# Altium project TRACKBAT.PRJPCB
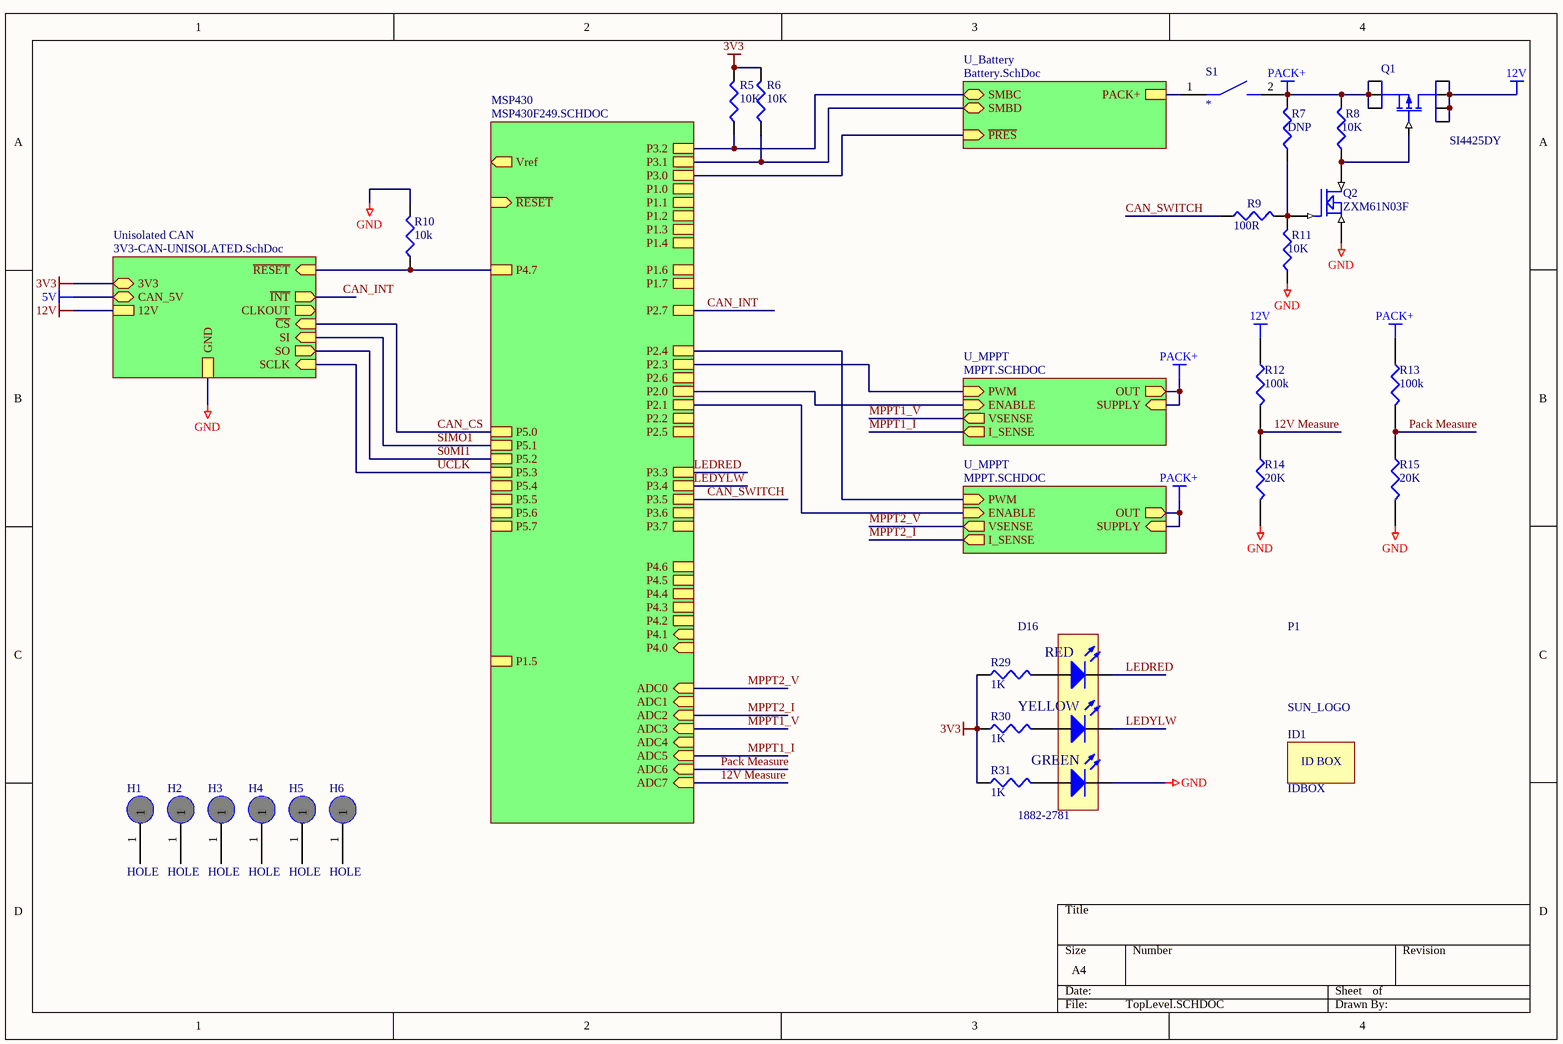
[diagram p0: TopLevel.SCHDOC]
2 sheets, 40 parts. Net scope: hierarchical (ports join the sheet entries above them; power ports are global).
Board file: RS-119-8912.PcbDoc
Sheets:
  TopLevel.SCHDOC
    MSP430 = MSP430F249.SCHDOC

## Sheet TopLevel.SCHDOC
size A4

### Parts
D16  1882-2781  [LED_TRILEVEL]
H1  HOLE  [M3]
H2  HOLE  [M3]
H3  HOLE  [M3]
H4  HOLE  [M3]
H5  HOLE  [M3]
H6  HOLE  [M3]
ID1  IDBOX  [IDBOX]
P1  SUN_LOGO  [SUNSWIFTLOGO]
Q1  SI4425DY  [SO8]
Q2  ZXM61N03F  [SOT23(3)]
R5  10K  [0603]
R6  10K  [0603]
R7  DNP  [0603]
R8  10K  [0603]
R9  100R  [0603]
R10  10k  [0603]
R11  10K  [0603]
R12  100k  [1206]
R13  100k  [1206]
R14  20K  [1206]
R15  20K  [1206]
R29  1K  [0603]
R30  1K  [0603]
R31  1K  [0603]
S1  *

### Sub-sheets
MSP430 = MSP430F249.SCHDOC: ADC0 (in), ADC1 (in), ADC2 (in), ADC3 (in), ADC4 (in), ADC5 (in), ADC6 (in), ADC7 (in), P1.0, P1.1, P1.2, P1.3, P1.4, P1.5, P1.6, P1.7, P2.0, P2.1, P2.2, P2.3, P2.4, P2.5, P2.6, P2.7, P3.0, P3.1, P3.2, P3.3, P3.4, Vref (out), ~{RESET} (in), P3.5, P3.6, P3.7, P4.0 (in), P4.1 (in), P4.2, P4.3, P4.4, P4.5, P4.6, P4.7, P5.0, P5.1, P5.2, P5.3, P5.4, P5.5, P5.6, P5.7
U_Battery = Battery.SchDoc (file not in this document): SMBD (bidir), SMBC (bidir), PACK+, ~{PRES} (in)
U_MPPT = MPPT.SCHDOC (file not in this document): ENABLE (in), OUT (out), VSENSE (out), PWM (in), I_SENSE (out), SUPPLY (in)
U_MPPT = MPPT.SCHDOC (file not in this document): ENABLE (in), OUT (out), VSENSE (out), PWM (in), I_SENSE (out), SUPPLY (in)
Unisolated CAN = 3V3-CAN-UNISOLATED.SchDoc (file not in this document): SI (in), SO (out), ~{CS} (in), SCLK (in), ~{INT} (out), ~{RESET} (in), 12V, GND, 3V3 (bidir), CLKOUT (out), CAN_5V (bidir)

### Nets
3V3: R5.2 R6.2 R29.1 R30.1 R31.1 ; sheet Unisolated CAN/3V3
5V: sheet Unisolated CAN/CAN_5V
12V: Q1.5(D) Q1.6(D) Q1.7(D) Q1.8(D) R12.1 ; sheet Unisolated CAN/12V
GND: D16.1(K) Q2.2(S) R10.2 R11.1 R14.2 R15.2 ; sheet Unisolated CAN/GND
PACK+: Q1.1(S) Q1.2(S) Q1.3(S) R7.2 R8.2 R13.1 S1.2 ; sheet U_MPPT/OUT, sheet U_MPPT/SUPPLY, sheet U_MPPT/OUT, sheet U_MPPT/SUPPLY
12V Measure: R12.2 R14.1 ; sheet MSP430/ADC7
CAN_CS: sheet Unisolated CAN/~{CS}, sheet MSP430/P5.0
CAN_INT: sheet Unisolated CAN/~{INT}, sheet MSP430/P2.7
CAN_SWITCH: R9.1 ; sheet MSP430/P3.5
LEDRED: D16.3(K) ; sheet MSP430/P3.3
LEDYLW: D16.2(K) ; sheet MSP430/P3.4
MPPT1_I: sheet MSP430/ADC5, sheet U_MPPT/I_SENSE  [project net ADC5]
MPPT1_V: sheet MSP430/ADC3, sheet U_MPPT/VSENSE  [project net ADC3]
MPPT2_I: sheet MSP430/ADC2, sheet U_MPPT/I_SENSE  [project net ADC2]
MPPT2_V: sheet MSP430/ADC0, sheet U_MPPT/VSENSE  [project net ADC0]
P2.0: sheet MSP430/P2.0, sheet U_MPPT/ENABLE
P2.1: sheet MSP430/P2.1, sheet U_MPPT/ENABLE
P2.3: sheet MSP430/P2.3, sheet U_MPPT/PWM
P2.4: sheet MSP430/P2.4, sheet U_MPPT/PWM
P3.0: sheet MSP430/P3.0, sheet U_Battery/~{PRES}
P3.1: R6.1 ; sheet MSP430/P3.1, sheet U_Battery/SMBD
P3.2: R5.1 ; sheet MSP430/P3.2, sheet U_Battery/SMBC
P4.7: R10.1 ; sheet Unisolated CAN/~{RESET}, sheet MSP430/P4.7
Pack Measure: R13.2 R15.1 ; sheet MSP430/ADC6  [project net ADC6]
S0MI1: sheet Unisolated CAN/SO, sheet MSP430/P5.2  [project net P5.2]
SIMO1: sheet Unisolated CAN/SI, sheet MSP430/P5.1  [project net P5.1]
UCLK: sheet Unisolated CAN/SCLK, sheet MSP430/P5.3  [project net P5.3]
NetD16_4: D16.4(A) R29.2
NetD16_5: D16.5(A) R30.2
NetD16_6: D16.6(A) R31.2
NetQ1_4: Q1.4(G) Q2.3(D) R8.1
NetQ2_1: Q2.1(G) R7.1 R9.2 R11.2
NetS1_1: S1.1 ; sheet U_Battery/PACK+

Not connected (* = marked no-connect by the designer): H1 1; H2 1; H3 1; H4 1; H5 1; H6 1

### Notes on the sheet
- (in symbol IDBOX) ID BOX
- (in symbol LED-TRILEVEL) RED; YELLOW; GREEN

### Library data of the parts
D16 = LED-TRILEVEL: Three level LED; Order#: 1461596; Price: 3.29; Supplier: Farnell
H1-H6 = HOLE: Order#: NA; Supplier: NA; Price: NA
Q1 = SI4425DY: SI4425DY P Channel Mosfet; Order#: 1057875; Price: 2.91; Supplier: Farnell
Q2 = ZXM61N02F: 1.7A, 20V N-Channel Enhancement mode FET; Order#: 9525289; Price: 0.73; Supplier: Farnell
R5-R8 R10 R11 = RES1: Resistor; Supplier: Stock
R9 = RES1: Supplier: Stock
R12 R13 = RES1: Order#: 308-6422; Price: 1.010; Supplier: Farnell
R14 R15 = RES1: Order#: 308-6252; Price: 1.010; Supplier: Farnell
R29-R31 = RES1: Resistor; Order#: 9331697; Supplier: Farnell; Price: 0.05
S1 = SWITCH: Order#: 108-2282; Price: 13.60; Supplier: Farnell

## Sheet MSP430F249.SCHDOC
size A4; Organization: UNSW Solar Racing Team; Address3: UNSW; Address4: Sydney NSW 2052; Address2: Electrical Engineering; Address1: Rm 109
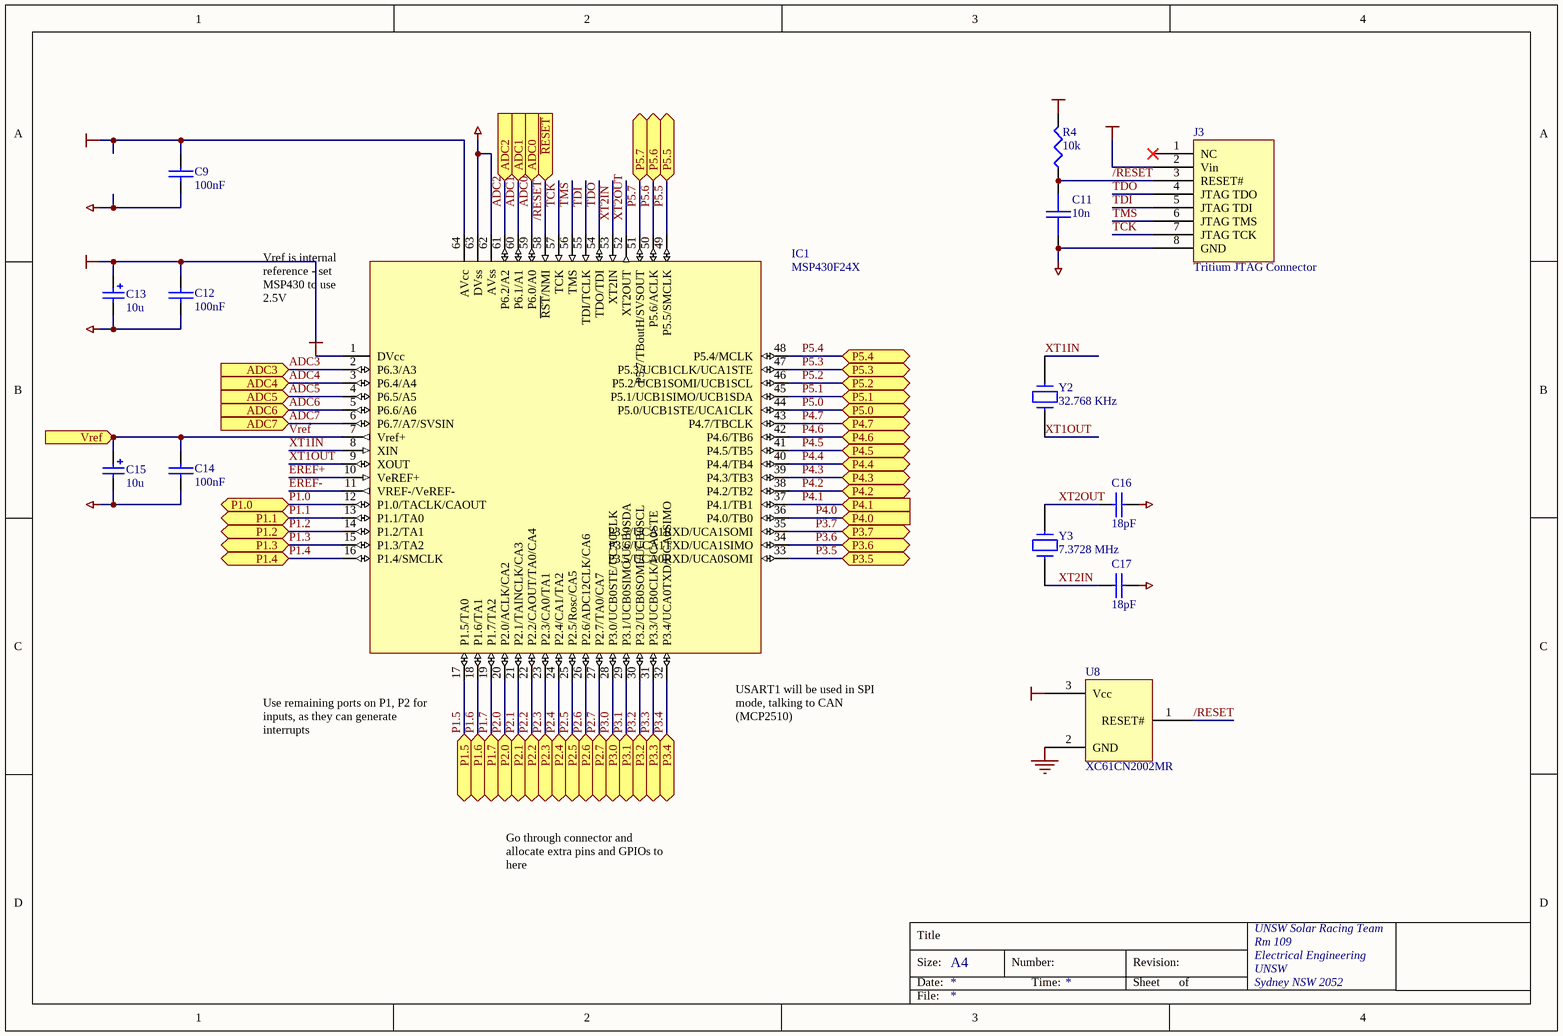
[diagram p1: MSP430F249.SCHDOC]

### Parts
C9  100nF  [0603]
C11  10n  [0603]
C12  100nF  [0603]
C13  10u  [0805]
C14  100nF  [0603]
C15  10u  [0805]
C16  18pF  [0603]
C17  18pF  [0603]
IC1  MSP430F24X  [QFP64]
J3  Tritium JTAG Connector  [IDC10]
R4  10k  [0603]
U8  XC61CN2002MR  [SOT23(3)]
Y2  32.768 KHz  [WATCHA]
Y3  7.3728 MHz  [HC49/4H]

### Ports
ADC0 (in), ADC1 (in), ADC2 (in), ADC3 (in), ADC4 (in), ADC5 (in), ADC6 (in), ADC7 (in), P1.0, P1.1, P1.2, P1.3, P1.4, P1.5, P1.6, P1.7, P2.0, P2.1, P2.2, P2.3, P2.4, P2.5, P2.6, P2.7, P3.0, P3.1, P3.2, P3.3, P3.4, P3.5, P3.6, P3.7, P4.0 (in), P4.1 (in), P4.2, P4.3, P4.4, P4.5, P4.6, P4.7, P5.0, P5.1, P5.2, P5.3, P5.4, P5.5, P5.6, P5.7, Vref (out), ~{RESET} (in)

### Nets
3V3: C9.1 C12.1 C13.1 IC1.1(DVcc) IC1.64(AVcc) J3.2(Vin) R4.2 U8.3(Vcc)
GND: C9.2 C11.2 C12.2 C13.2 C14.2 C15.2 C16.2 C17.2 IC1.62(AVss) IC1.63(DVss) J3.8(GND) U8.2(GND)
/RESET: C11.1 IC1.58(~{RST}/NMI) J3.3(RESET#) R4.1 U8.1(RESET#) ; port ~{RESET}
ADC0: IC1.59(P6.0/A0) ; port ADC0
ADC1: IC1.60(P6.1/A1) ; port ADC1
ADC2: IC1.61(P6.2/A2) ; port ADC2
ADC3: IC1.2(P6.3/A3) ; port ADC3
ADC4: IC1.3(P6.4/A4) ; port ADC4
ADC5: IC1.4(P6.5/A5) ; port ADC5
ADC6: IC1.5(P6.6/A6) ; port ADC6
ADC7: IC1.6(P6.7/A7/SVSIN) ; port ADC7  [project net 12V Measure]
EREF+: IC1.10(VeREF+)
EREF-: IC1.11(VREF-/VeREF-)
P1.0: IC1.12(P1.0/TACLK/CAOUT) ; port P1.0
P1.1: IC1.13(P1.1/TA0) ; port P1.1
P1.2: IC1.14(P1.2/TA1) ; port P1.2
P1.3: IC1.15(P1.3/TA2) ; port P1.3
P1.4: IC1.16(P1.4/SMCLK) ; port P1.4
P1.5: IC1.17(P1.5/TA0) ; port P1.5
P1.6: IC1.18(P1.6/TA1) ; port P1.6
P1.7: IC1.19(P1.7/TA2) ; port P1.7
P2.0: IC1.20(P2.0/ACLK/CA2) ; port P2.0
P2.1: IC1.21(P2.1/TAINCLK/CA3) ; port P2.1
P2.2: IC1.22(P2.2/CAOUT/TA0/CA4) ; port P2.2
P2.3: IC1.23(P2.3/CA0/TA1) ; port P2.3
P2.4: IC1.24(P2.4/CA1/TA2) ; port P2.4
P2.5: IC1.25(P2.5/Rosc/CA5) ; port P2.5
P2.6: IC1.26(P2.6/ADC12CLK/CA6) ; port P2.6
P2.7: IC1.27(P2.7/TA0/CA7) ; port P2.7  [project net CAN_INT]
P3.0: IC1.28(P3.0/UCB0STE/UCA0CLK) ; port P3.0
P3.1: IC1.29(P3.1/UCB0SIMO/UCB0SDA) ; port P3.1
P3.2: IC1.30(P3.2/UCB0SOMI/UCB0SCL) ; port P3.2
P3.3: IC1.31(P3.3/UCB0CLK/UCA0STE) ; port P3.3  [project net LEDRED]
P3.4: IC1.32(P3.4/UCA0TXD/UCA0SIMO) ; port P3.4  [project net LEDYLW]
P3.5: IC1.33(P3.5/UCA0RXD/UCA0SOMI) ; port P3.5  [project net CAN_SWITCH]
P3.6: IC1.34(P3.6/UCA1TXD/UCA1SIMO) ; port P3.6
P3.7: IC1.35(P3.7/UCA1RXD/UCA1SOMI) ; port P3.7
P4.0: IC1.36(P4.0/TB0) ; port P4.0
P4.1: IC1.37(P4.1/TB1) ; port P4.1
P4.2: IC1.38(P4.2/TB2) ; port P4.2
P4.3: IC1.39(P4.3/TB3) ; port P4.3
P4.4: IC1.40(P4.4/TB4) ; port P4.4
P4.5: IC1.41(P4.5/TB5) ; port P4.5
P4.6: IC1.42(P4.6/TB6) ; port P4.6
P4.7: IC1.43(P4.7/TBCLK) ; port P4.7
P5.0: IC1.44(P5.0/UCB1STE/UCA1CLK) ; port P5.0  [project net CAN_CS]
P5.1: IC1.45(P5.1/UCB1SIMO/UCB1SDA) ; port P5.1
P5.2: IC1.46(P5.2/UCB1SOMI/UCB1SCL) ; port P5.2
P5.3: IC1.47(P5.3/UCB1CLK/UCA1STE) ; port P5.3
P5.4: IC1.48(P5.4/MCLK) ; port P5.4
P5.5: IC1.49(P5.5/SMCLK) ; port P5.5
P5.6: IC1.50(P5.6/ACLK) ; port P5.6
P5.7: IC1.51(P5.7/TBoutH/SVSOUT) ; port P5.7
TCK: IC1.57(TCK) J3.7(JTAG_TCK)
TDI: IC1.55(TDI/TCLK) J3.5(JTAG_TDI)
TDO: IC1.54(TDO/TDI) J3.4(JTAG_TDO)
TMS: IC1.56(TMS) J3.6(JTAG_TMS)
Vref: C14.1 C15.1 IC1.7(Vref+) ; port Vref
XT1IN: IC1.8(XIN) Y2.1
XT1OUT: IC1.9(XOUT) Y2.2
XT2IN: C17.1 IC1.53(XT2IN) Y3.1
XT2OUT: C16.1 IC1.52(XT2OUT) Y3.2

Not connected (* = marked no-connect by the designer): J3 1(NC)*

### Notes on the sheet
- (near IC1) Vref is internal reference - set MSP430 to use 2.5V
- (near IC1) Use remaining ports on P1, P2 for inputs, as they can generate interrupts
- (near IC1) USART1 will be used in SPI mode, talking to CAN (MCP2510)
- Go through connector and allocate extra pins and GPIOs to here
- Title
- Size:
- Date:
- A4
- Number:
- Time:
- Revision:
- Sheet
- of
- File:

### Library data of the parts
C9 C11 C12 C14 C16 C17 = CAP: Capacitor; Supplier: Stock
C13 C15 = Cap Pol3: Polarized Capacitor (Surface Mount); Order#: 521-2820; Price: 0.489; Supplier: Farnell
J3 = 430F_JTAG_TRITIUM: Tritium JTAG interface for MSP430; Order#: 511-808; Price: 1.32; Supplier: Farnell
R4 = RES1: Resistor; Supplier: Stock
U8 = XC61F: SOT23 reset generator; Farnell: NA
Y2 Y3 = CRYSTAL
  Y2: Supplier: Stock
  Y3: Supplier: Farnell

## Nets that join several sheets
3V3: TopLevel (5 pins), MSP430F249 (8 pins)
GND: TopLevel (6 pins), MSP430F249 (12 pins)
12V Measure: TopLevel (R12.2 R14.1), MSP430F249 (IC1.6)
ADC6: TopLevel (R13.2 R15.1), MSP430F249 (IC1.5)
CAN_SWITCH: TopLevel (R9.1), MSP430F249 (IC1.33)
LEDRED: TopLevel (D16.3), MSP430F249 (IC1.31)
LEDYLW: TopLevel (D16.2), MSP430F249 (IC1.32)
P3.1: TopLevel (R6.1), MSP430F249 (IC1.29)
P3.2: TopLevel (R5.1), MSP430F249 (IC1.30)
P4.7: TopLevel (R10.1), MSP430F249 (IC1.43)